# Altium schematic sheet [02] MainBoard.SchDoc
size A2
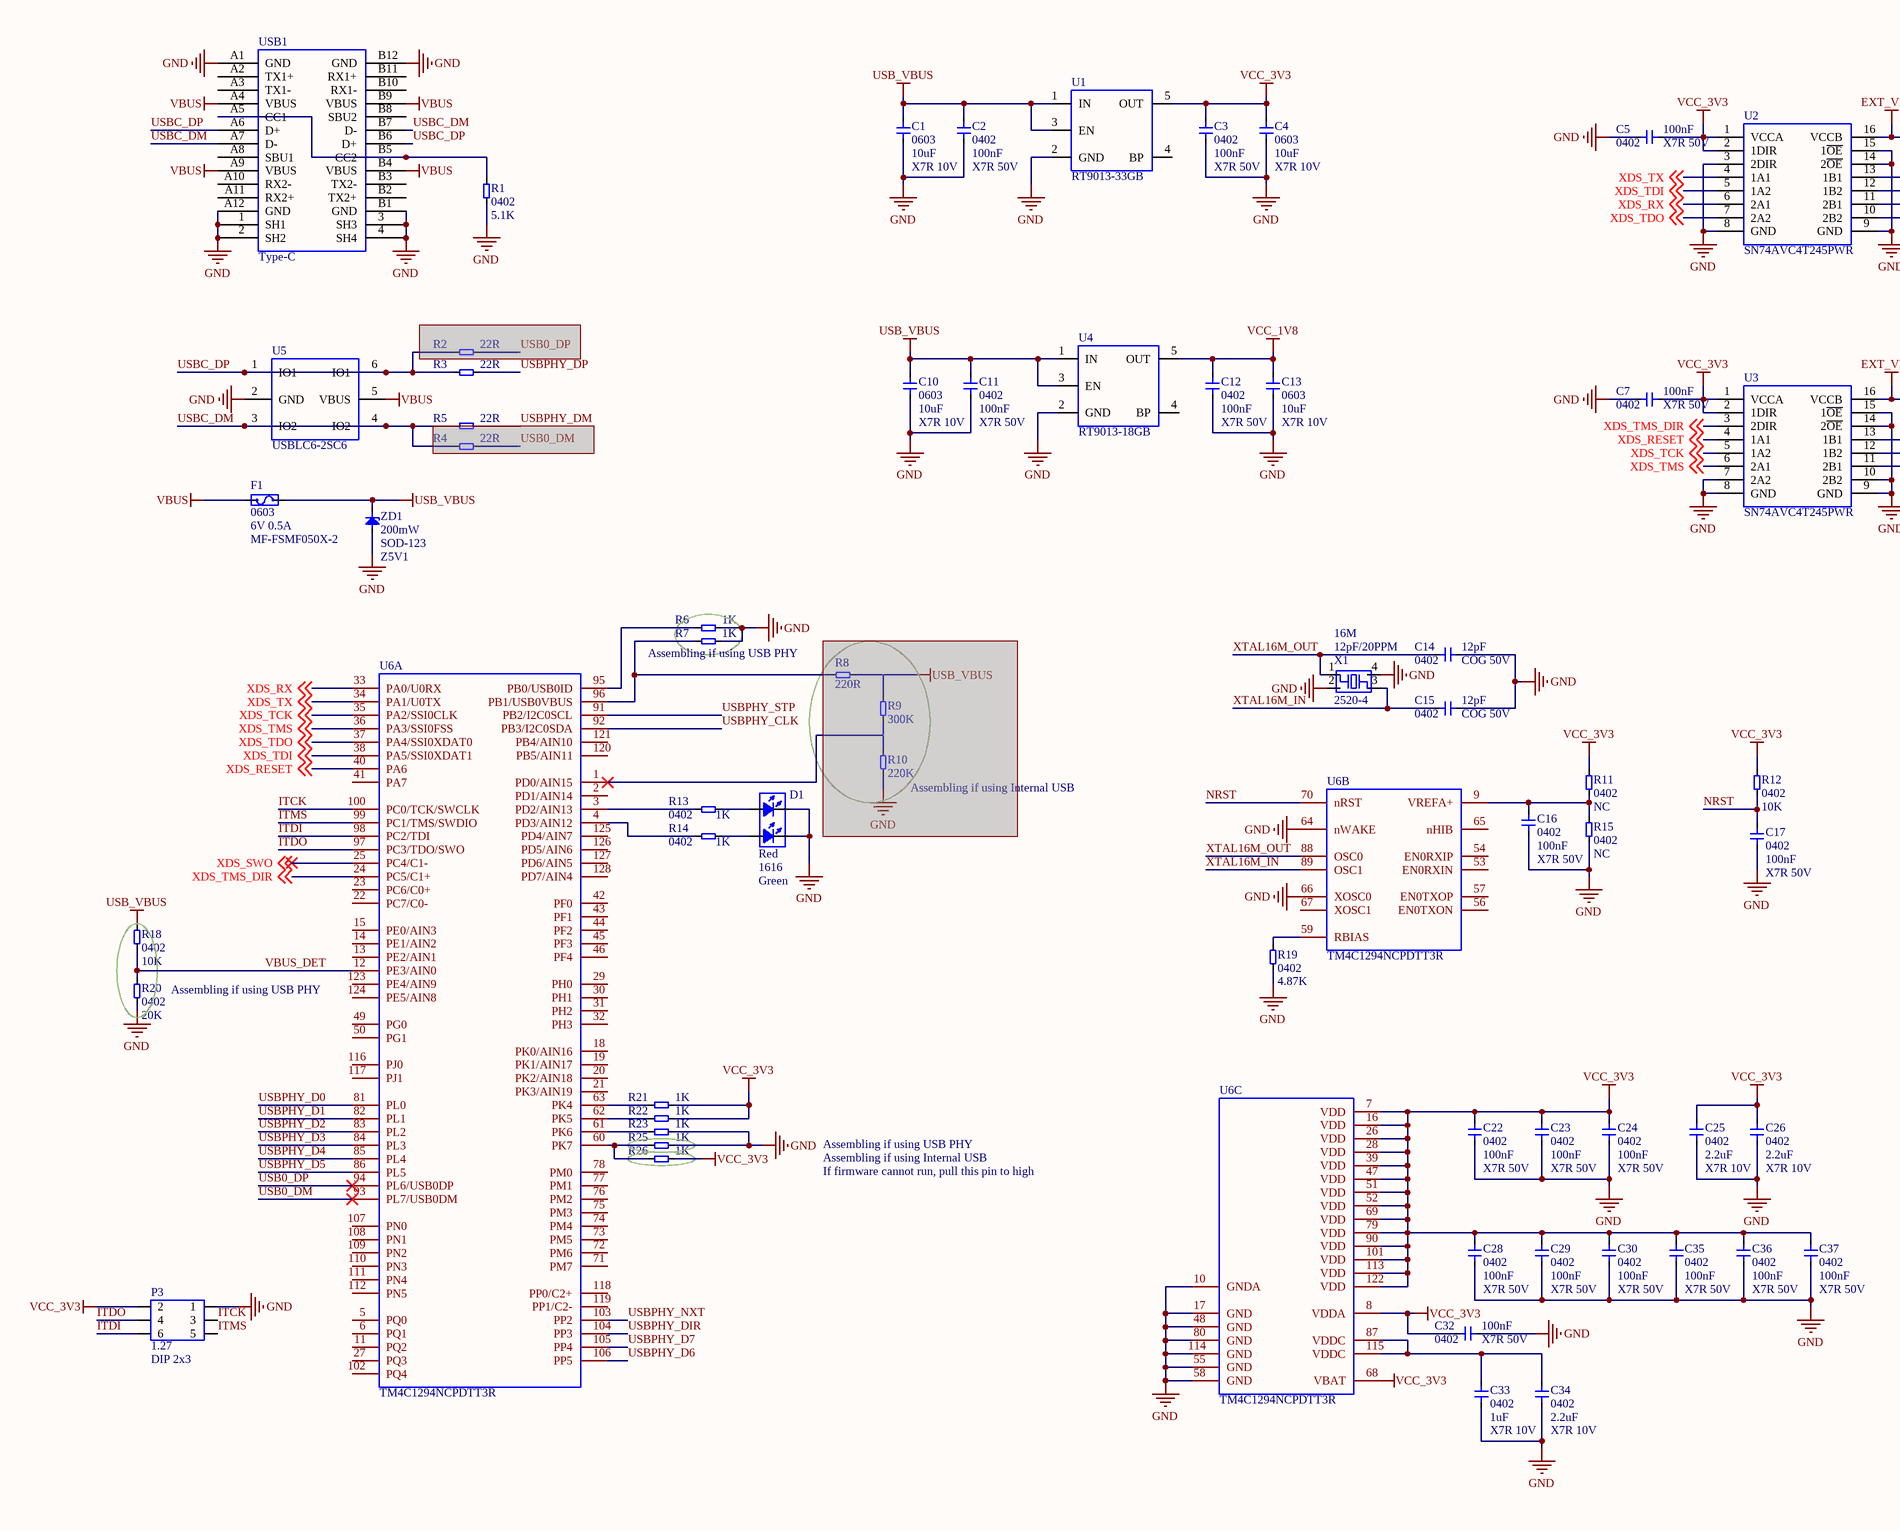
[diagram p0: [02] MainBoard.SchDoc, left]
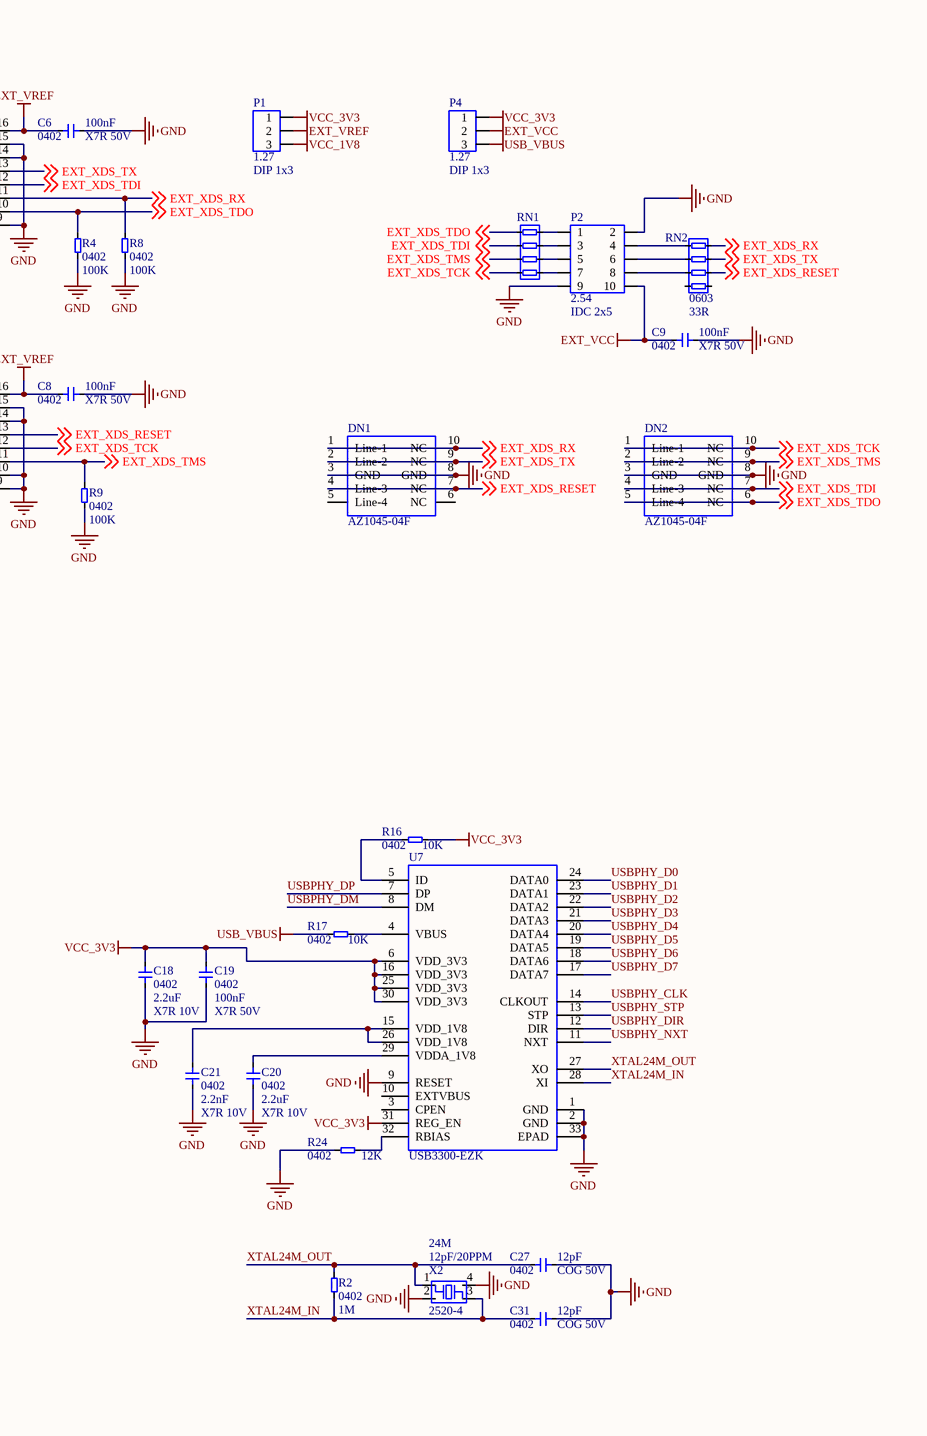
[diagram p1: [02] MainBoard.SchDoc, right]

## Parts
(Parts that share a designator on the sheet are numbered #1, #2 ... from top to bottom, then left to right.)
C1  Footprint: 0603  Specification: X7R 10V  [CAP_0603]  (hidden comment: 10uF)
C2  Footprint: 0402  Specification: X7R 50V  [CAP_0402]  (hidden comment: 100nF)
C3  Footprint: 0402  Specification: X7R 50V  [CAP_0402]  (hidden comment: 100nF)
C4  Footprint: 0603  Specification: X7R 10V  [CAP_0603]  (hidden comment: 10uF)
C5  Footprint: 0402  Specification: X7R 50V  [CAP_0402]  (hidden comment: 100nF)
C6  Footprint: 0402  Specification: X7R 50V  [CAP_0402]  (hidden comment: 100nF)
C7  Footprint: 0402  Specification: X7R 50V  [CAP_0402]  (hidden comment: 100nF)
C8  Footprint: 0402  Specification: X7R 50V  [CAP_0402]  (hidden comment: 100nF)
C9  Footprint: 0402  Specification: X7R 50V  [CAP_0402]  (hidden comment: 100nF)
C10  Footprint: 0603  Specification: X7R 10V  [CAP_0603]  (hidden comment: 10uF)
C11  Footprint: 0402  Specification: X7R 50V  [CAP_0402]  (hidden comment: 100nF)
C12  Footprint: 0402  Specification: X7R 50V  [CAP_0402]  (hidden comment: 100nF)
C13  Footprint: 0603  Specification: X7R 10V  [CAP_0603]  (hidden comment: 10uF)
C14  Footprint: 0402  Specification: COG 50V  [CAP_0402]  (hidden comment: 12pF)
C15  Footprint: 0402  Specification: COG 50V  [CAP_0402]  (hidden comment: 12pF)
C16  Footprint: 0402  Specification: X7R 50V  [CAP_0402]  (hidden comment: 100nF)
C17  Footprint: 0402  Specification: X7R 50V  [CAP_0402]  (hidden comment: 100nF)
C18  Footprint: 0402  Specification: X7R 10V  [CAP_0402]  (hidden comment: 2.2uF)
C19  Footprint: 0402  Specification: X7R 50V  [CAP_0402]  (hidden comment: 100nF)
C20  Footprint: 0402  Specification: X7R 10V  [CAP_0402]  (hidden comment: 2.2uF)
C21  Footprint: 0402  Specification: X7R 10V  [CAP_0402]  (hidden comment: 2.2nF)
C22  Footprint: 0402  Specification: X7R 50V  [CAP_0402]  (hidden comment: 100nF)
C23  Footprint: 0402  Specification: X7R 50V  [CAP_0402]  (hidden comment: 100nF)
C24  Footprint: 0402  Specification: X7R 50V  [CAP_0402]  (hidden comment: 100nF)
C25  Footprint: 0402  Specification: X7R 10V  [CAP_0402]  (hidden comment: 2.2uF)
C26  Footprint: 0402  Specification: X7R 10V  [CAP_0402]  (hidden comment: 2.2uF)
C27  Footprint: 0402  Specification: COG 50V  [CAP_0402]  (hidden comment: 12pF)
C28  Footprint: 0402  Specification: X7R 50V  [CAP_0402]  (hidden comment: 100nF)
C29  Footprint: 0402  Specification: X7R 50V  [CAP_0402]  (hidden comment: 100nF)
C30  Footprint: 0402  Specification: X7R 50V  [CAP_0402]  (hidden comment: 100nF)
C31  Footprint: 0402  Specification: COG 50V  [CAP_0402]  (hidden comment: 12pF)
C32  Footprint: 0402  Specification: X7R 50V  [CAP_0402]  (hidden comment: 100nF)
C33  Footprint: 0402  Specification: X7R 10V  [CAP_0402]  (hidden comment: 1uF)
C34  Footprint: 0402  Specification: X7R 10V  [CAP_0402]  (hidden comment: 2.2uF)
C35  Footprint: 0402  Specification: X7R 50V  [CAP_0402]  (hidden comment: 100nF)
C36  Footprint: 0402  Specification: X7R 50V  [CAP_0402]  (hidden comment: 100nF)
C37  Footprint: 0402  Specification: X7R 50V  [CAP_0402]  (hidden comment: 100nF)
D1  Value2: Red  Footprint: 1616  Value1: Green  [LED_1616]
DN1  AZ1045-04F  [DFN-2510]
DN2  AZ1045-04F  [DFN-2510]
F1  Footprint: 0603  Specification: 6V 0.5A  [FUSE_0603]  (hidden comment: MF-FSMF050X-2)
P1  Type: 1.27  [HDR1X3_1.27_180]  (hidden comment: DIP 1x3)
P2  Type: 2.54  [HDR2X5_2.54_180H]  (hidden comment: IDC 2x5)
P3  Type: 1.27  [HDR2X3_1.27_180]  (hidden comment: DIP 2x3)
P4  Type: 1.27  [HDR1X3_1.27_180]  (hidden comment: DIP 1x3)
R1  Footprint: 0402  [RES_0402]  (hidden comment: 5.1K)
R2#1  22R  [RES_0402]  (masked out: inside a compile mask, not in the netlist)
R2#2  Footprint: 0402  [RES_0402]  (hidden comment: 1M)
R3  22R  [RES_0402]
R4#1  Footprint: 0402  [RES_0402]  (hidden comment: 100K)
R4#2  22R  [RES_0402]  (masked out: inside a compile mask, not in the netlist)
R5  22R  [RES_0402]  (masked out: inside a compile mask, not in the netlist)
R6  1K  [RES_0402]
R7  1K  [RES_0402]
R8#1  Footprint: 0402  [RES_0402]  (hidden comment: 100K)
R8#2  220R  [RES_0402]  (masked out: inside a compile mask, not in the netlist)
R9#1  Footprint: 0402  [RES_0402]  (hidden comment: 100K)
R9#2  300K  [RES_0402]  (masked out: inside a compile mask, not in the netlist)
R10  220K  [RES_0402]  (masked out: inside a compile mask, not in the netlist)
R11  Footprint: 0402  [RES_0402]  (hidden comment: NC)
R12  Footprint: 0402  [RES_0402]  (hidden comment: 10K)
R13  Footprint: 0402  [RES_0402]  (hidden comment: 1K)
R14  Footprint: 0402  [RES_0402]  (hidden comment: 1K)
R15  Footprint: 0402  [RES_0402]  (hidden comment: NC)
R16  Footprint: 0402  [RES_0402]  (hidden comment: 10K)
R17  Footprint: 0402  [RES_0402]  (hidden comment: 10K)
R18  Footprint: 0402  [RES_0402]  (hidden comment: 10K)
R19  Footprint: 0402  [RES_0402]  (hidden comment: 4.87K)
R20  Footprint: 0402  [RES_0402]  (hidden comment: 20K)
R21  1K  [RES_0402]
R22  1K  [RES_0402]
R23  1K  [RES_0402]
R24  Footprint: 0402  [RES_0402]  (hidden comment: 12K)
R25  1K  [RES_0402]
R26  1K  [RES_0402]
RN1  33R  [RES_0603X4]  (value not drawn)
RN2  Footprint: 0603  [RES_0603X4]  (hidden comment: 33R)
U1  RT9013-33GB  [SOT-23-5]
U2  SN74AVC4T245PWR  [TSSOP-16-P0.65]
U3  SN74AVC4T245PWR  [TSSOP-16-P0.65]
U4  RT9013-18GB  [SOT-23-5]
U5  USBLC6-2SC6  [SOT-23-6]
U6  TM4C1294NCPDTT3R  [LQFP-128]  (parts A,B,C of 3)
U7  USB3300-EZK  [QFN-32-5x5-P0.5]
USB1  Type-C  [USB-Type-C]
X1  Specification: 16M  Footprint: 2520-4  [XTAL_2520-4]  (hidden comment: 12pF/20PPM)
X2  Specification: 24M  Footprint: 2520-4  [XTAL_2520-4]  (hidden comment: 12pF/20PPM)
ZD1  Specification: 200mW  [SOD-123]  (hidden comment: Z5V1)

## Nets
EXT_VCC: C9.2 P2.10 P4.2
EXT_VREF: C6.2 C8.2 P1.2 U2.16(VCCB) U3.16(VCCB)
GND: C1.1 C2.1 C3.1 C4.1 C5.2 C6.1 C7.2 C8.1 C9.1 C10.1 C11.1 C12.1 C13.1 C14.1 C15.1 C16.1 C17.1 C18.1 C19.1 C20.1 C21.1 C22.1 C23.1 C24.1 C25.1 C26.1 C27.1 C28.1 C29.1 C30.1 C31.1 C32.1 C33.1 C34.1 C35.1 C36.1 C37.1 D1.1 D1.2 DN1.3(GND) DN1.8(GND) DN2.3(GND) DN2.8(GND) P2.2 P2.9 P3.1 R1.1 R4#1.1 R6.2 R7.2 R8#1.1 R9#1.1 R15.1 R19.1 R20.1 R23.2 R24.1 R25.2 U1.2(GND) U2.3(2DIR) U2.8(GND) U2.9(GND) U2.14(2~{OE}) U2.15(1~{OE}) U3.7(2A2) U3.8(GND) U3.9(GND) U3.10(2B2) U3.14(2~{OE}) U3.15(1~{OE}) U4.2(GND) U5.2(GND) U6.10(GNDA) U6.17(GND) U6.48(GND) U6.55(GND) U6.58(GND) U6.64(nWAKE) U6.66(XOSC0) U6.80(GND) U6.114(GND) U7.1(GND) U7.2(GND) U7.9(RESET) U7.33(EPAD) USB1.1(SH1) USB1.2(SH2) USB1.3(SH3) USB1.4(SH4) USB1.A1(GND) USB1.A12(GND) USB1.B1(GND) USB1.B12(GND) X1.2(GND) X1.4(GND) X2.2(GND) X2.4(GND) ZD1.1
USB_VBUS: C1.2 C2.2 C10.2 C11.2 F1.2 P4.3 R17.2 R18.2 U1.1(IN) U1.3(EN) U4.1(IN) U4.3(EN) ZD1.2
VBUS: F1.1 U5.5(VBUS) USB1.A4(VBUS) USB1.A9(VBUS) USB1.B4(VBUS) USB1.B9(VBUS)
VCC_1V8: C12.2 C13.2 P1.3 U4.5(OUT)
VCC_3V3: C3.2 C4.2 C5.1 C7.1 C18.2 C19.2 C22.2 C23.2 C24.2 C25.2 C26.2 C28.2 C29.2 C30.2 C32.2 C35.2 C36.2 C37.2 P1.1 P3.2 P4.1 R11.2 R12.2 R16.1 R21.2 R22.2 R26.2 U1.5(OUT) U2.1(VCCA) U2.2(1DIR) U3.1(VCCA) U3.2(1DIR) U6.7(VDD) U6.8(VDDA) U6.16(VDD) U6.26(VDD) U6.28(VDD) U6.39(VDD) U6.47(VDD) U6.51(VDD) U6.52(VDD) U6.68(VBAT) U6.69(VDD) U6.79(VDD) U6.90(VDD) U6.101(VDD) U6.113(VDD) U6.122(VDD) U7.6(VDD_3V3) U7.16(VDD_3V3) U7.25(VDD_3V3) U7.30(VDD_3V3) U7.31(REG_EN)
EXT_XDS_RESET: DN1.4(Line-3) DN1.7(NC) RN2.6 U3.13(1B1) ; off-sheet EXT_XDS_RESET
EXT_XDS_RX: DN1.1(Line-1) DN1.10(NC) R8#1.2 RN2.8 U2.11(2B1) ; off-sheet EXT_XDS_RX
EXT_XDS_TCK: DN2.1(Line-1) DN2.10(NC) RN1.1 U3.12(1B2) ; off-sheet EXT_XDS_TCK
EXT_XDS_TDI: DN2.4(Line-3) DN2.7(NC) RN1.3 U2.12(1B2) ; off-sheet EXT_XDS_TDI
EXT_XDS_TDO: DN2.5(Line-4) DN2.6(NC) R4#1.2 RN1.4 U2.10(2B2) ; off-sheet EXT_XDS_TDO
EXT_XDS_TMS: DN2.2(Line-2) DN2.9(NC) R9#1.2 RN1.2 U3.11(2B1) ; off-sheet EXT_XDS_TMS
EXT_XDS_TX: DN1.2(Line-2) DN1.9(NC) RN2.7 U2.13(1B1) ; off-sheet EXT_XDS_TX
ITCK: P3.3 U6.100(PC0/TCK/SWCLK)
ITDI: P3.6 U6.98(PC2/TDI)
ITDO: P3.4 U6.97(PC3/TDO/SWO)
ITMS: P3.5 U6.99(PC1/TMS/SWDIO)
NRST: C17.2 R12.1 U6.70(nRST)
USB0_DM: U6.93(PL7/USB0DM)
USB0_DP: U6.94(PL6/USB0DP)
USBC_DM: U5.3(IO2) U5.4(IO2) USB1.A7(D-) USB1.B7(D-)
USBC_DP: R3.1 U5.1(IO1) U5.6(IO1) USB1.A6(D+) USB1.B6(D+)
USBPHY_CLK: U6.92(PB3/I2C0SDA) U7.14(CLKOUT)
USBPHY_D0: U6.81(PL0) U7.24(DATA0)
USBPHY_D1: U6.82(PL1) U7.23(DATA1)
USBPHY_D2: U6.83(PL2) U7.22(DATA2)
USBPHY_D3: U6.84(PL3) U7.21(DATA3)
USBPHY_D4: U6.85(PL4) U7.20(DATA4)
USBPHY_D5: U6.86(PL5) U7.19(DATA5)
USBPHY_D6: U6.106(PP5) U7.18(DATA6)
USBPHY_D7: U6.105(PP4) U7.17(DATA7)
USBPHY_DIR: U6.104(PP3) U7.12(DIR)
USBPHY_DM: U7.8(DM)
USBPHY_DP: R3.2 U7.7(DP)
USBPHY_NXT: U6.103(PP2) U7.11(NXT)
USBPHY_STP: U6.91(PB2/I2C0SCL) U7.13(STP)
VBUS_DET: R18.1 R20.2 U6.12(PE3/AIN0)
XDS_RESET: U3.4(1A1) U6.40(PA6) ; off-sheet XDS_RESET
XDS_RX: U2.6(2A1) U6.33(PA0/U0RX) ; off-sheet XDS_RX
XDS_SWO: U6.25(PC4/C1-) ; off-sheet XDS_SWO
XDS_TCK: U3.5(1A2) U6.35(PA2/SSI0CLK) ; off-sheet XDS_TCK
XDS_TDI: U2.5(1A2) U6.38(PA5/SSI0XDAT1) ; off-sheet XDS_TDI
XDS_TDO: U2.7(2A2) U6.37(PA4/SSI0XDAT0) ; off-sheet XDS_TDO
XDS_TMS: U3.6(2A1) U6.36(PA3/SSI0FSS) ; off-sheet XDS_TMS
XDS_TMS_DIR: U3.3(2DIR) U6.24(PC5/C1+) ; off-sheet XDS_TMS_DIR
XDS_TX: U2.4(1A1) U6.34(PA1/U0TX) ; off-sheet XDS_TX
XTAL16M_IN: C15.2 U6.89(OSC1) X1.3(OUT)
XTAL16M_OUT: C14.2 U6.88(OSC0) X1.1(IN)
XTAL24M_IN: C31.2 R2#2.1 U7.28(XI) X2.3(OUT)
XTAL24M_OUT: C27.2 R2#2.2 U7.27(XO) X2.1(IN)
NetC16_2: C16.2 R11.1 R15.2 U6.9(VREFA+)
NetC20_2: C20.2 U7.29(VDDA_1V8)
NetC21_2: C21.2 U7.15(VDD_1V8) U7.26(VDD_1V8)
NetC33_2: C33.2 C34.2 U6.87(VDDC) U6.115(VDDC)
NetD1_3: D1.3 R14.2
NetD1_4: D1.4 R13.2
NetP2_1: P2.1 RN1.5
NetP2_3: P2.3 RN1.6
NetP2_4: P2.4 RN2.1
NetP2_5: P2.5 RN1.7
NetP2_6: P2.6 RN2.2
NetP2_7: P2.7 RN1.8
NetP2_8: P2.8 RN2.3
NetR1_2: R1.2 USB1.A5(CC1) USB1.B5(CC2)
NetR6_1: R6.1 U6.95(PB0/USB0ID)
NetR7_1: R7.1 U6.96(PB1/USB0VBUS)
NetR13_1: R13.1 U6.3(PD2/AIN13)
NetR14_1: R14.1 U6.4(PD3/AIN12)
NetR16_2: R16.2 U7.5(ID)
NetR17_1: R17.1 U7.4(VBUS)
NetR19_2: R19.2 U6.59(RBIAS)
NetR21_1: R21.1 U6.63(PK4)
NetR22_1: R22.1 U6.62(PK5)
NetR23_1: R23.1 U6.61(PK6)
NetR24_2: R24.2 U7.32(RBIAS)
NetR25_1: R25.1 R26.1 U6.60(PK7)

Not connected (* = marked no-connect by the designer): DN1 5(Line-4) 6(NC); RN2 4 5; U1 4(BP); U4 4(BP); U6 1(PD0/AIN15)* 2(PD1/AIN14) 5(PQ0) 6(PQ1) 11(PQ2) 13(PE2/AIN1) 14(PE1/AIN2) 15(PE0/AIN3) 18(PK0/AIN16) 19(PK1/AIN17) 20(PK2/AIN18) 21(PK3/AIN19) 22(PC7/C0-) 23(PC6/C0+) 27(PQ3) 29(PH0) 30(PH1) 31(PH2) 32(PH3) 41(PA7) 42(PF0) 43(PF1) 44(PF2) 45(PF3) 46(PF4) 49(PG0) 50(PG1) 53(EN0RXIN) 54(EN0RXIP) 56(EN0TXON) 57(EN0TXOP) 65(nHIB) 67(XOSC1) 71(PM7) 72(PM6) 73(PM5) 74(PM4) 75(PM3) 76(PM2) 77(PM1) 78(PM0) 102(PQ4) 107(PN0) 108(PN1) 109(PN2) 110(PN3) 111(PN4) 112(PN5) 116(PJ0) 117(PJ1) 118(PP0/C2+) 119(PP1/C2-) 120(PB5/AIN11) 121(PB4/AIN10) 123(PE4/AIN9) 124(PE5/AIN8) 125(PD4/AIN7) 126(PD5/AIN6) 127(PD6/AIN5) 128(PD7/AIN4); U7 3(CPEN) 10(EXTVBUS); USB1 A2(TX1+) A3(TX1-) A8(SBU1) A10(RX2-) A11(RX2+) B2(TX2+) B3(TX2-) B8(SBU2) B10(RX1-) B11(RX1+)

## Notes on the sheet
- (near R7) Assembling if using USB PHY
- (near R10) Assembling if using Internal USB
- Assembling if using USB PHY
- Assembling if using Internal USB
- If firmware cannot run, pull this pin to high
- Title
- Size:
- Date:
- A4
- Number:
- Time:
- Revision:
- Sheet
- of
- File:

## Library data of the parts
C1-C37 = CAP: Capacitor; Manufacturer: *
  C1 C4 C10 C13: Value: 10uF
  C2 C3 C5-C9 C11 C12 C16 C17 C19 C22-C24 C28-C30 C32 C35-C37: Value: 100nF
  C14 C15 C27 C31: Value: 12pF
  C18 C20 C25 C26 C34: Value: 2.2uF
  C21: Value: 2.2nF
  C33: Value: 1uF
D1 = LEDx2: LED双色
DN1 DN2 = ESD_Array_4: ESD_Array; Specification: 6V; Value: AZ1045-04F
F1 = Fuse: Manufacturer: *; Value: MF-FSMF050X-2
P1 P4 = HDR1x3: Header; Value: DIP 1x3
P2 = HDR2x5: Header; Value: IDC 2x5
P3 = HDR2x3: Header; Value: DIP 2x3
R1 R2#1 R2#2 R3 R4#1 R4#2 R5-R7 R8#1 R8#2 R9#1 R9#2 R10-R26 = RES: Resistor; Specification: ±1%; Manufacturer: *
  R1: Value: 5.1K
  R2#1 R3 R4#2 R5: Footprint: 0402; Value: 22R
  R2#2: Value: 1M
  R4#1 R8#1 R9#1: Value: 100K
  R6 R7 R21-R23 R25 R26: Footprint: 0402; Value: 1K
  R8#2: Footprint: 0402; Value: 220R
  R9#2: Footprint: 0402; Value: 300K
  R10: Footprint: 0402; Value: 220K
  R11 R15: Value: NC
  R12 R16-R18: Value: 10K
  R13 R14: Value: 1K
  R19: Value: 4.87K
  R20: Value: 20K
  R24: Value: 12K
RN1 RN2 = RES-4: Resistor Array; Specification: ±5%; Value: 33R
  RN1: Footprint: 0603
U1 U4 = RT9193: LDO
U2 U3 = SN74AVC4T245: 具有可配置电压转换和三态输出的 4 位双电源总线收发器
U5 = USBLC6-2: Very low capacitance ESD protection
U6 = TM4C1294NCPDT: 32-bit Arm Cortex-M4F based MCU with 120-MHZ, 1-MB flash, 256-KB RAM, USB, ENET MAC+PHY
U7 = USB3300: Hi-Speed USB Host, Device or OTG PHY with ULPI Low Pin Interface
USB1 = USB-Type-C
X1 X2 = XTAL-4P: Value: 12pF/20PPM
ZD1 = Diode-ZD: Zender Diode; Manufacturer: *; Value: Z5V1